# EAGLE design prozeda_0.2 (EAGLE 7.5.0)
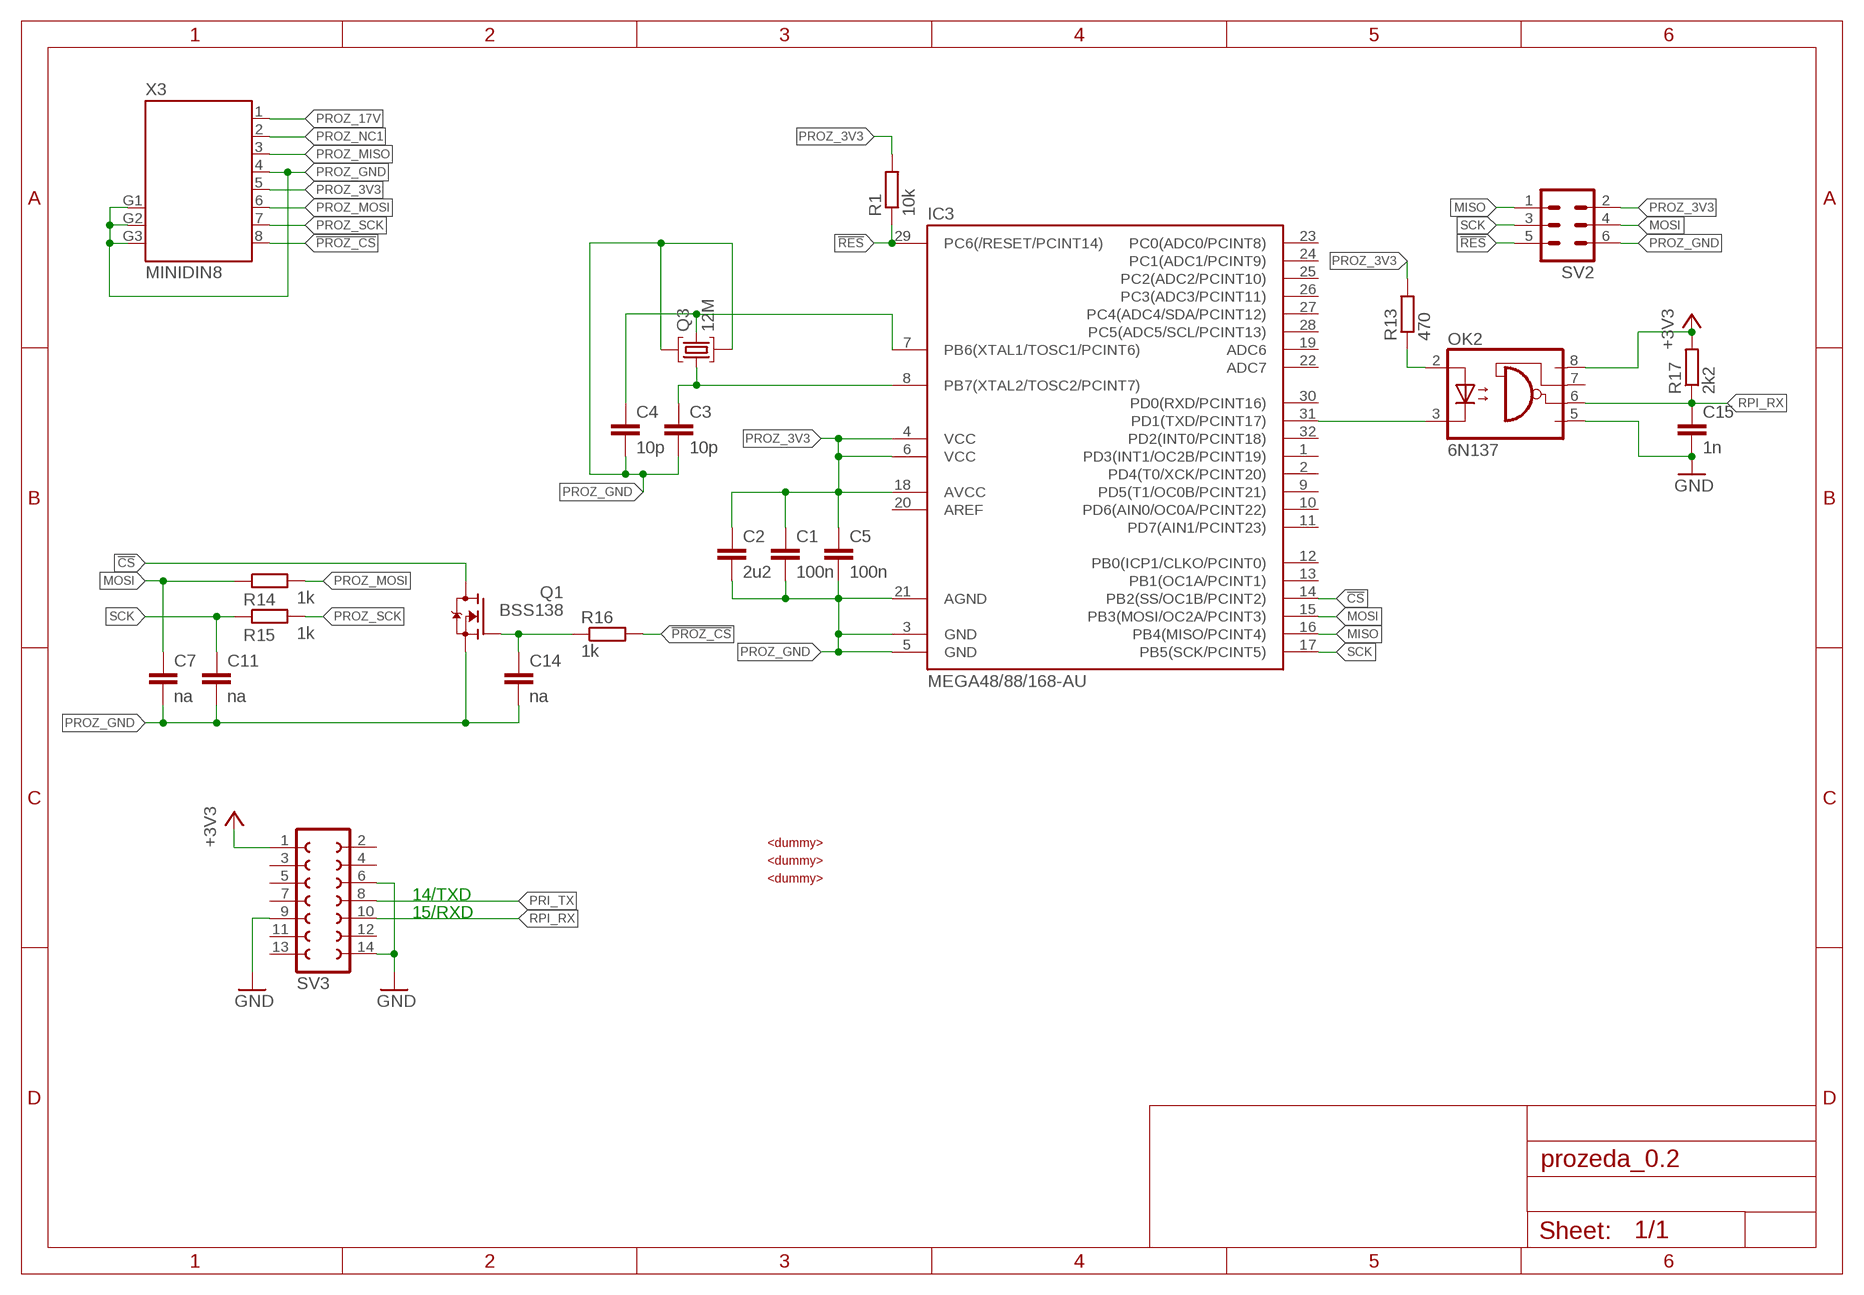
[diagram p0: schematic, sheet 1]

## Parts
C1  100n  C-EUC0603  [C0603]
C2  2u2  C-EUC0805  [C0805]
C3  10p  C-EUC0603  [C0603]
C4  10p  C-EUC0603  [C0603]
C5  100n  C-EUC0603  [C0603]
C7  na  C-EUC0603  [C0603]
C11  na  C-EUC0603  [C0603]
C14  na  C-EUC0603  [C0603]
C15  1n  C-EUC0603  [C0603]
IC3  MEGA48/88/168-AU  [TQFP32-08]
OK2  6N137  [DIL08]
Q1  BSS138  [SOT23]
Q3  12M  SMD4PADMJ  [MJ]
R1  10k  R-EU_R0603  [R0603]
R13  470  R-EU_R0603  [R0603]
R14  1k  R-EU_R0603  [R0603]
R15  1k  R-EU_R0603  [R0603]
R16  1k  R-EU_R0603  [R0603]
R17  2k2  R-EU_R0603  [R0603]
SV2  MA03-2  [MA03-2]
SV3  FE07-2  [FE07-2]
U$1  DUMMY  [DUMMY]
U$2  DUMMY  [DUMMY]
U$3  DUMMY  [DUMMY]
X3  MINIDIN8  [MINI-DIN8]

## Nets
!CS: IC3.14(PB2(SS/OC1B/PCINT2)) Q1.3(D)
!PROZ_CS: R16.2 X3.8
!RES: IC3.29(PC6(/RESET/PCINT14)) R1.1 SV2.5
+3V3: OK2.8(VCC) R17.2 SV3.1
GND: C15.2 OK2.5(GND) SV3.6 SV3.9 SV3.14
MISO: IC3.16(PB4(MISO/PCINT4)) SV2.1
MOSI: C7.1 IC3.15(PB3(MOSI/OC2A/PCINT3)) R14.1 SV2.4
N$2: C3.1 IC3.8(PB7(XTAL2/TOSC2/PCINT7)) Q3.1
N$3: C4.1 IC3.7(PB6(XTAL1/TOSC1/PCINT6)) Q3.3
N$49: C14.1 Q1.1(G) R16.1
N$50: IC3.31(PD1(TXD/PCINT17)) OK2.3(C)
N$54: OK2.2(A) R13.1
PRI_TX: SV3.8
PROZ_3V3: C1.1 C2.1 C5.1 IC3.4(VCC) IC3.6(VCC) IC3.18(AVCC) R1.2 R13.2 SV2.2 X3.5
PROZ_17V: X3.1
PROZ_GND: C1.2 C2.2 C3.2 C4.2 C5.2 C7.2 C11.2 C14.2 IC3.3(GND) IC3.5(GND) IC3.21(AGND) Q1.2(S) Q3.2 Q3.4 SV2.6 X3.4 X3.G1 X3.G2 X3.G3
PROZ_MISO: X3.3
PROZ_MOSI: R14.2 X3.6
PROZ_NC1: X3.2
PROZ_SCK: R15.2 X3.7
RPI_RX: C15.1 OK2.6(VO) R17.1 SV3.10
SCK: C11.1 IC3.17(PB5(SCK/PCINT5)) R15.1 SV2.3
Unconnected: IC3.1(PD3(INT1/OC2B/PCINT19)) IC3.2(PD4(T0/XCK/PCINT20)) IC3.9(PD5(T1/OC0B/PCINT21)) IC3.10(PD6(AIN0/OC0A/PCINT22)) IC3.11(PD7(AIN1/PCINT23)) IC3.12(PB0(ICP1/CLKO/PCINT0)) IC3.13(PB1(OC1A/PCINT1)) IC3.19(ADC6) IC3.20(AREF) IC3.22(ADC7) IC3.23(PC0(ADC0/PCINT8)) IC3.24(PC1(ADC1/PCINT9)) IC3.25(PC2(ADC2/PCINT10)) IC3.26(PC3(ADC3/PCINT11)) IC3.27(PC4(ADC4/SDA/PCINT12)) IC3.28(PC5(ADC5/SCL/PCINT13)) IC3.30(PD0(RXD/PCINT16)) IC3.32(PD2(INT0/PCINT18)) OK2.7(VE) SV3.2 SV3.3 SV3.4 SV3.5 SV3.7 SV3.11 SV3.12 SV3.13

## Notes on the sheet
- 14/TXD
- 15/RXD

## Library data of the parts
C1 C5 = rcl:C-EU: CAPACITOR, European symbol; OC_REICHELT: X7R-G0603 100N
C2 = rcl:C-EU: CAPACITOR, European symbol; OC_REICHELT: KEM X5R0805 2,2U
C3 C4 = rcl:C-EU: CAPACITOR, European symbol; OC_REICHELT: X7R-G0603 10p
C7 C11 C14 = rcl:C-EU: CAPACITOR, European symbol; OC_REICHELT: X7R-G0603 220p
C15 = rcl:C-EU: CAPACITOR, European symbol; OC_REICHELT: X7R-G0603 1np
IC3 = avr-7:MEGA48/88/168; OC_REICHELT: ATMEGA 88PA-AU
OK2 = optocoupler:6N137: MOTOROLA OPTO COUPLER; MPN: 6N137; OC_FARNELL: 1328376; OC_NEWARK: 52M1895; OC_REICHELT: 6N 137
Q1 = transistor-fet:BSS138; OC_FARNELL: 9845330; OC_REICHELT: BSS 138 SMD
Q3 = crystal:SMD4PAD; OC_REICHELT: 12,000000-MJ
R1 = rcl:R-EU_: RESISTOR, European symbol; OC_REICHELT: RND 0603 1 10K
R13 = rcl:R-EU_: RESISTOR, European symbol; OC_REICHELT: RND 0603 1 470
R14-R16 = rcl:R-EU_: RESISTOR, European symbol; OC_REICHELT: RND 0603 1 1K
R17 = rcl:R-EU_: RESISTOR, European symbol; OC_REICHELT: RND 0603 1 2,2K
SV2 = con-lstb:MA03-2: PIN HEADER; OC_FARNELL: unknown; OC_NEWARK: unknown
SV3 = con-lsta:FE07-2: FEMALE HEADER
U$1 = dummy:DUMMY; OC_REICHELT: EB-DIO M08
U$2 U$3 = dummy:DUMMY; OC_REICHELT: SE-DIO M08
X3 = con-minidin:MINIDIN8; OC_REICHELT: EB-DIOS M08

## Board
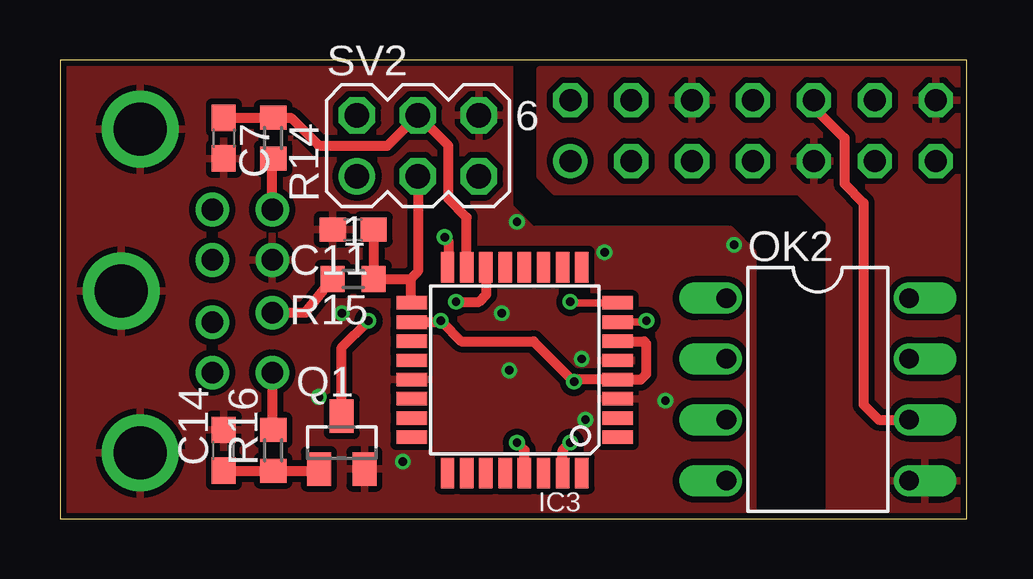
[diagram p1: board, top side]
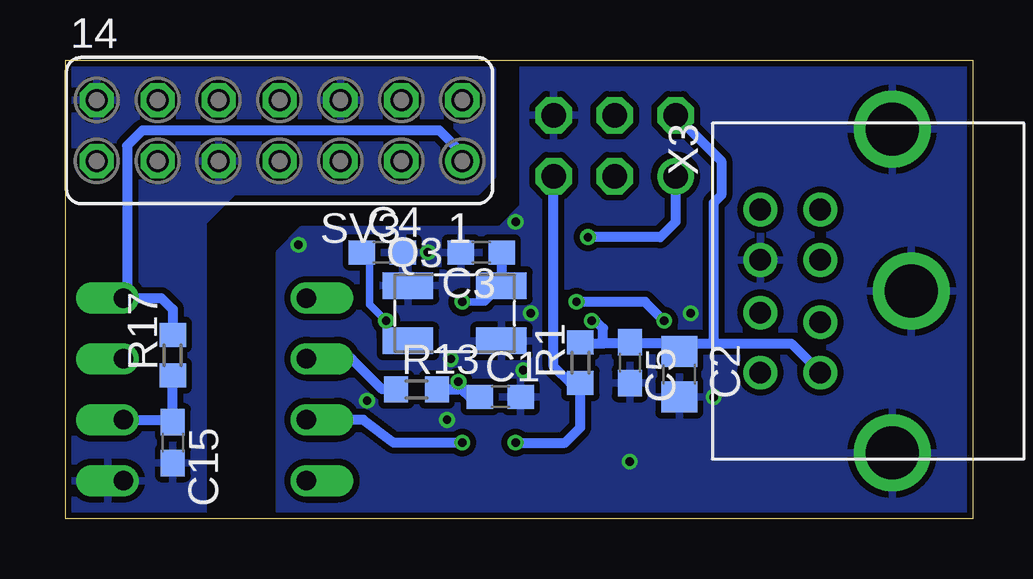
[diagram p2: board, bottom side, seen from below]

Size 37.8 x 19.14 mm. Coordinates in mm from the lower left corner, seen from the top.
Outline: 0,0 37.8,0 37.8,19.14 0,19.14 0,0
Copper layers (1*16): Top 0.035mm / dielectric 1.5mm / Bottom 0.035mm
Design rules "dirt_cheap_dirty_boards.v1": minimum track width 5mil, minimum drill 12mil, track to track 5mil, track to pad 5mil, pad to pad 5mil, via to via 5mil, smd to smd 0mil, copper to edge 10mil, drill to drill 10mil, minimum pad ring 10mil, minimum via ring 6mil, stop-mask expansion 2mil, vias tented up to drill 25mil, thermal gap 10mil

### Footprints (pad centres in the part's own frame; a part is rotated, then mirrored left to right if it is on the bottom)
C0603 = smd 1.1 x 1: 1 -0.85,0; 2 0.85,0
C0805 = smd 1.3 x 1.5: 1 -0.95,0; 2 0.95,0
TQFP32-08 = smd 1.27 x 0.559: 1 -4.293,2.8; 2 -4.293,2; 3 -4.293,1.2; 4 -4.293,0.4; 5 -4.293,-0.4; 6 -4.293,-1.2; 7 -4.293,-2; 8 -4.293,-2.8; 17 4.293,-2.8; 18 4.293,-2; 19 4.293,-1.2; 20 4.293,-0.4; 21 4.293,0.4; 22 4.293,1.2; 23 4.293,2; 24 4.293,2.8 | smd 0.559 x 1.27: 9 -2.8,-4.293; 10 -2,-4.293; 11 -1.2,-4.293; 12 -0.4,-4.293; 13 0.4,-4.293; 14 1.2,-4.293; 15 2,-4.293; 16 2.8,-4.293; 25 2.8,4.293; 26 2,4.293; 27 1.2,4.293; 28 0.4,4.293; 29 -0.4,4.293; 30 -1.2,4.293; 31 -2,4.293; 32 -2.8,4.293
DIL08 = drill 0.813 offset: 1 -3.81,-3.81; 2 -1.27,-3.81; 3 1.27,-3.81; 4 3.81,-3.81; 5 3.81,3.81; 6 1.27,3.81; 7 -1.27,3.81; 8 -3.81,3.81
SOT23 = smd 1 x 1.4: 1 -0.95,-1.1; 2 0.95,-1.1; 3 0,1.1
MJ = smd 2.1 x 1.1: 1 1.95,1.15; 2 -1.95,1.15; 3 -1.95,-1.15; 4 1.95,-1.15
R0603 = smd 1 x 1.1: 1 -0.85,0; 2 0.85,0
MA03-2 = drill 1.016: 1 -2.54,-1.27 | drill 1.016 octagon: 2 -2.54,1.27; 3 0,-1.27; 4 0,1.27; 5 2.54,-1.27; 6 2.54,1.27
FE07-2 = drill 0.914: 1 -7.62,1.27 | drill 0.914 octagon: 2 -7.62,-1.27; 3 -5.08,1.27; 4 -5.08,-1.27; 5 -2.54,1.27; 6 -2.54,-1.27; 7 0,1.27; 8 0,-1.27; 9 2.54,1.27; 10 2.54,-1.27; 11 5.08,1.27; 12 5.08,-1.27; 13 7.62,1.27; 14 7.62,-1.27
MINI-DIN8 = drill 0.9: 1 0,0; 2 2.6,0; 3 -2.1,0; 4 0,-2.5; 5 4.7,0; 6 -2.1,-2.5; 7 2.2,-2.5; 8 4.7,-2.5 | drill 2.2: G1 -5.45,3; G2 1.3,3.8; G3 8.05,3

### Placement (x,y rotation side)
C1  19.68,5.08 0 bottom
C2  12.22,6.03 270 bottom
C3  20.48,11.11 180 bottom
C4  24.61,11.11 0 bottom
C5  14.29,6.51 270 bottom
C7  6.83,15.88 270 top
C11  12.22,12.06 180 top
C14  6.83,2.86 90 top
C15  33.34,3.17 270 bottom
IC3  18.96,6.2 180 top
OK2  31.59,5.4 270 top
Q1  11.75,3.17 0 top
Q3  21.59,8.57 0 bottom
R1  16.35,6.51 90 bottom
R13  23.18,5.4 0 bottom
R14  8.89,15.88 270 top
R15  12.22,10 180 top
R16  8.89,2.86 90 top
R17  33.34,6.83 90 bottom
SV2  14.92,15.56 0 top
SV3  28.89,16.19 180 bottom
U$1  -1.91,-0.64 0 top
U$2  -2.54,-1.91 0 top
U$3  -3.17,-3.17 0 top  (outside the outline)
X3  6.35,10.79 270 bottom

### Tracks (layer width: path | path; a pad name or v marks a point on that pad's centre or on a via)
!CS  (via drill 0.35)
  Top 0.406: Q1.3 11.75,7.14 v12.86,8.26 | v16.51,9.05 17.46,9.05 17.78,9.37 17.78,10.47 IC3.14
  Bottom 0.406: v12.86,8.26 13.65,9.05 v16.51,9.05
!PROZ_CS
  Top 0.406: X3.8 8.85,3.75 R16.2
!RES  (via drill 0.35)
  Top 0.406: IC3.29 19.37,2.86 v19.05,3.17
  Bottom 0.406: v19.05,3.17 16.99,3.17 16.35,3.81 R1.1 16.77,5.66 17.46,6.35 SV2.5
+3V3
  Bottom 0.406: R17.2 33.34,8.73 33.81,9.21 OK2.8 35.24,9.37 35.24,15.56 34.61,16.19 22.23,16.19 21.27,15.24 SV3.1
GND
  pour Top (isolate 0.254): 20,18.73 20,14.29 20.64,13.65 30.8,13.65 32.07,12.38 32.07,0.32 37.47,0.32 37.47,18.73
  pour Bottom (isolate 0.254): 20,18.73 20,14.29 20.64,13.65 30.8,13.65 32.07,12.38 32.07,0.32 37.47,0.32 37.47,18.73
MISO  (via drill 0.35)
  Top 0.406: v16.03,11.75 16.19,11.59 16.19,10.53 IC3.16
  Bottom 0.406: SV2.1 12.38,12.38 13.02,11.75 v16.03,11.75
MOSI
  Top 0.406: C7.1 R14.1 9.63,16.73 10.79,15.56 13.65,15.56 SV2.4 16.19,15.56 16.19,13.34 16.96,12.57 IC3.15
N$2  (via drill 0.35)
  Top 0.305: v21.27,9.05 21.32,9 IC3.8
  Bottom 0.305: Q3.1 20.31,9.05 v21.27,9.05
  Bottom 0.406: C3.1 19.63,9.73 Q3.1
N$3  (via drill 0.35)
  Top 0.305: IC3.7 24.39,8.2 v24.45,8.26
  Bottom 0.305: Q3.3 23.74,7.62 24.45,7.62 v24.45,8.26 25.14,8.95 25.14,10.79 C4.1
N$49
  Top 0.406: C14.1 R16.1 9.21,2.01 10.73,2.01 Q1.1
N$50  (via drill 0.35)
  Top 0.406: IC3.31 20.95,2.86 v21.27,3.17
  Bottom 0.406: v21.27,3.17 24.13,3.17 25.4,4.13 OK2.3
N$54
  Bottom 0.406: R13.1 24.61,5.4 25.88,6.67 OK2.2
PROZ_3V3  (via drill 0.35)
  Top 0.406: 15.93,8.2 v15.88,8.26 | IC3.18 15.93,8.2 | 15.93,8.2 16.73,7.4 19.74,7.4 v21.43,5.71 21.52,5.8 IC3.4 24.22,5.8 24.45,6.03 24.45,7.3 24.35,7.4 IC3.6
  Bottom 0.406: SV2.2 10.48,14.92 10.48,13.49 10.79,13.18 10.79,7.3 | 10.79,7.3 7.56,7.3 X3.5 | 12.22,7.3 14.29,7.3 | 14.29,7.3 15.4,7.3 | C2.1 12.22,7.3 | 12.22,7.3 10.79,7.3 | C1.1 20.95,5.08 21.27,5.4 R13.2 21.43,5.4 v21.43,5.71 | 15.4,7.3 15.4,7.94 15.72,8.26 v15.88,8.26 | R1.2 16.3,7.3 15.4,7.3 | C5.1 14.29,7.3
PROZ_GND  (via drill 0.35)
  other vias: 25.24,4.92 14.29,2.38 19.05,12.38 28.1,11.43 10.79,5.08 11.75,8.57 22.7,11.11 18.73,6.19 18.41,8.57 21.75,6.67 21.91,4.13
  pour Top (isolate 0.254, rank 6): 0.32,18.89 0.32,0.32 28.89,0.32 28.89,11.11 27.94,12.06 19.68,12.06 18.73,13.02 18.73,18.89
  pour Bottom (isolate 0.254, rank 6): 0.32,18.89 0.32,0.32 28.89,0.32 28.89,11.11 27.94,12.06 19.68,12.06 18.73,13.02 18.73,18.89
PROZ_MOSI
  Top 0.406: X3.6 8.85,14.98 R14.2
PROZ_SCK
  Top 0.406: X3.7 10.24,8.6 R15.2
RPI_RX
  Top 0.406: OK2.6 34.13,4.13 33.5,4.76 33.5,13.18 32.7,13.97 32.7,15.88 31.43,17.14 SV3.10
  Bottom 0.406: OK2.6 33.34,4.13 | 33.34,4.13 R17.1 | C15.1 33.34,4.13
SCK
  Top 0.406: IC3.17 14.66,9.15 14.61,9.21 14.61,10 | SV2.3 14.92,10.32 14.61,10 | 14.61,10 R15.1 C11.1